# Altium schematic sheet control-interface.SchDoc
size A4; SheetNumber: 2; SheetTotal: 4
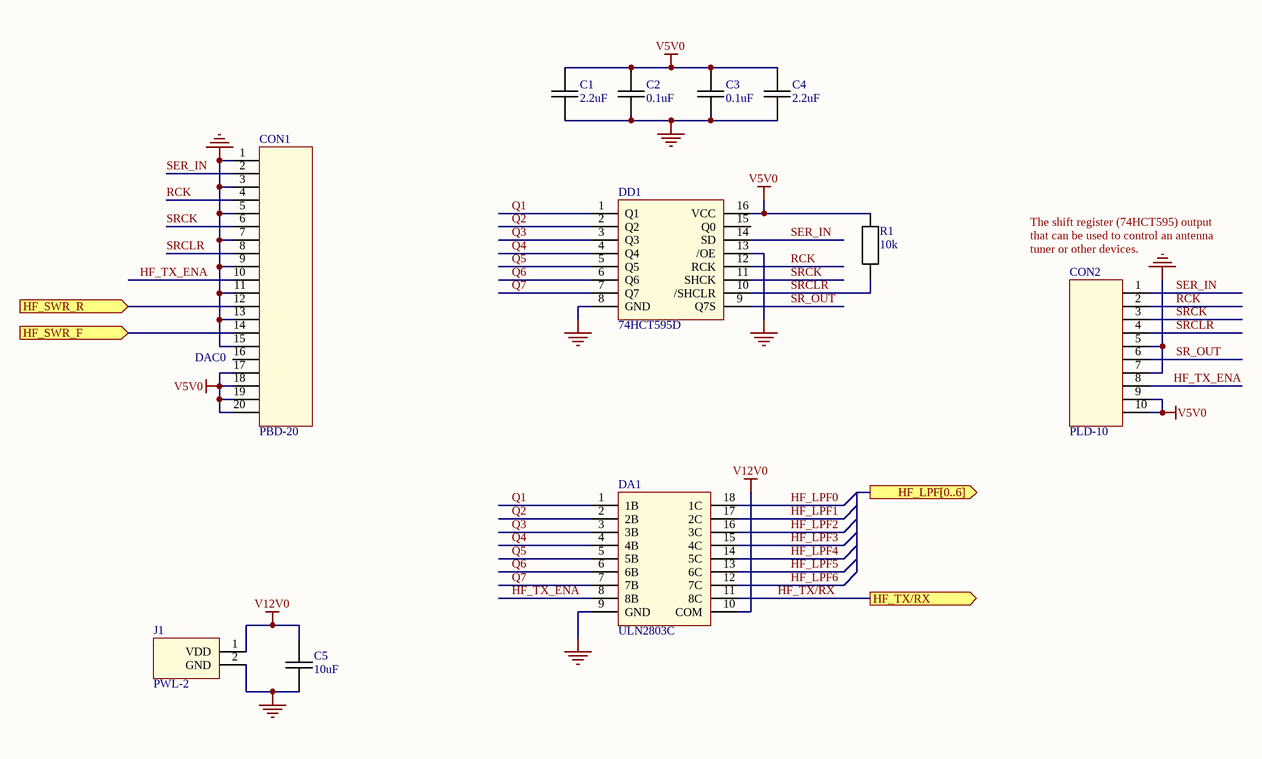
[diagram p0: control-interface.SchDoc]

## Parts
C1  2.2uF  [CAPC2013X100N]
C2  0.1uF  [CAPC2013X100N]
C3  0.1uF  [CAPC2013X100N]
C4  2.2uF  [CAPC2013X100N]
C5  10uF  [CAPC2013X100N]
CON1  PBD-20  [PBD-20]
CON2  PLD-10  [PLD-10R]
DA1  ULN2803C  [SOIC127P1030X265-18N]
DD1  74HCT595D  [SOIC127P600X175-16N]
J1  PWL-2  [PWL-2R]
R1  10k  [RESC2013X64N]

## Ports
HF_LPF[0..6] (out), HF_SWR_F (in), HF_SWR_R (in), HF_TX/RX (out)

## Nets
GND: C1.1 C2.1 C3.1 C4.1 C5.2 CON1.1 CON1.3 CON1.5 CON1.7 CON1.9 CON1.11 CON1.13 CON1.15 CON2.5 CON2.7 DA1.9(GND) DD1.8(GND) DD1.13(/OE) J1.2(GND)
V5V0: C1.2 C2.2 C3.2 C4.2 CON1.17 CON1.18 CON1.19 CON1.20 CON2.9 CON2.10 DD1.16(VCC) R1.2
V12V0: C5.1 DA1.10(COM) J1.1(VDD)
HF_LPF0: DA1.18(1C)
HF_LPF1: DA1.17(2C)
HF_LPF2: DA1.16(3C)
HF_LPF3: DA1.15(4C)
HF_LPF4: DA1.14(5C)
HF_LPF5: DA1.13(6C)
HF_LPF6: DA1.12(7C)
HF_SWR_F: CON1.14 ; port HF_SWR_F
HF_SWR_R: CON1.12 ; port HF_SWR_R
HF_TX/RX: DA1.11(8C) ; port HF_TX/RX
HF_TX_ENA: CON1.10 CON2.8 DA1.8(8B)
Q1: DA1.1(1B) DD1.1(Q1)
Q2: DA1.2(2B) DD1.2(Q2)
Q3: DA1.3(3B) DD1.3(Q3)
Q4: DA1.4(4B) DD1.4(Q4)
Q5: DA1.5(5B) DD1.5(Q5)
Q6: DA1.6(6B) DD1.6(Q6)
Q7: DA1.7(7B) DD1.7(Q7)
RCK: CON1.4 CON2.2 DD1.12(RCK)
SER_IN: CON1.2 CON2.1 DD1.14(SD)
SR_OUT: CON2.6 DD1.9(Q7S)
SRCK: CON1.6 CON2.3 DD1.11(SHCK)
SRCLR: CON1.8 CON2.4 DD1.10(/SHCLR) R1.1

Not connected (* = marked no-connect by the designer): CON1 16; DD1 15(Q0)

## Notes on the sheet
- (near CON2) The shift register (74HCT595) output that can be used to control an antenna tuner or other devices.
- (near CON1) DAC0

## Library data of the parts
C1-C5 = Cap0805: Capacitor 2x1.25 mm
CON1 = CONNECTOR-20
CON2 = CONNECTOR-10
DA1 = ULN2803A: Darlington Transistor Array
DD1 = 74HCT595D: 8-bit serial-in, serial or parallel-out shift register with output / latches; 3-state
J1 = PWR_CONNECTOR
R1 = Res0805